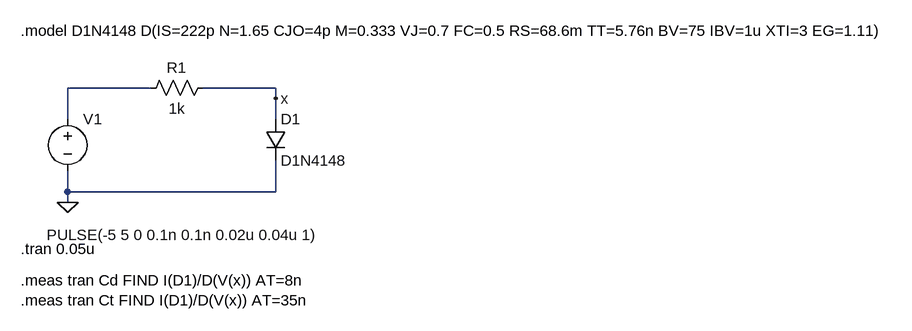
[diagram p0: schematic ej1.2.asc]
ej1.2.asc, the LTspice schematic file:
Version 4.1
SHEET 1 1264 680
WIRE 16 96 -112 96
WIRE 208 96 96 96
WIRE 208 112 208 96
WIRE -112 144 -112 96
WIRE 208 144 208 112
WIRE -112 256 -112 224
WIRE 208 256 208 208
WIRE 208 256 -112 256
WIRE -112 272 -112 256
FLAG -112 272 0
FLAG 208 112 x
SYMBOL voltage -112 128 R0
WINDOW 3 -32 194 Left 2
WINDOW 123 0 0 Left 0
WINDOW 39 0 0 Left 0
SYMATTR Value PULSE(-5 5 0 0.1n 0.1n 0.02u 0.04u 1)
SYMATTR InstName V1
SYMBOL res 112 80 R90
WINDOW 0 0 56 VBottom 2
WINDOW 3 32 56 VTop 2
SYMATTR InstName R1
SYMATTR Value 1k
SYMBOL diode 192 144 R0
SYMATTR InstName D1
SYMATTR Value D1N4148
TEXT -184 8 Left 2 !.model D1N4148 D(IS=222p N=1.65 CJO=4p M=0.333 VJ=0.7 FC=0.5 RS=68.6m TT=5.76n BV=75 IBV=1u XTI=3 EG=1.11)
TEXT -184 344 Left 2 !.tran 0.05u
TEXT -184 392 Left 2 !.meas tran Cd FIND I(D1)/D(V(x)) AT=8n\n.meas tran Ct FIND I(D1)/D(V(x)) AT=35n

The netlist it stands for:
* ej1.2.asc
V1 N001 0 PULSE(-5 5 0 0.1n 0.1n 0.02u 0.04u 1)
R1 x N001 1k
D1 x 0 D1N4148
.model D D
.lib standard.dio
.model D1N4148 D(IS=222p N=1.65 CJO=4p M=0.333 VJ=0.7 FC=0.5 RS=68.6m TT=5.76n BV=75 IBV=1u XTI=3 EG=1.11)
.tran 0.05u
.meas tran Cd FIND I(D1)/D(V(x)) AT=8n
.meas tran Ct FIND I(D1)/D(V(x)) AT=35n
.backanno
.end

* Results of the author's LTspice run, read from the files saved beside the schematic
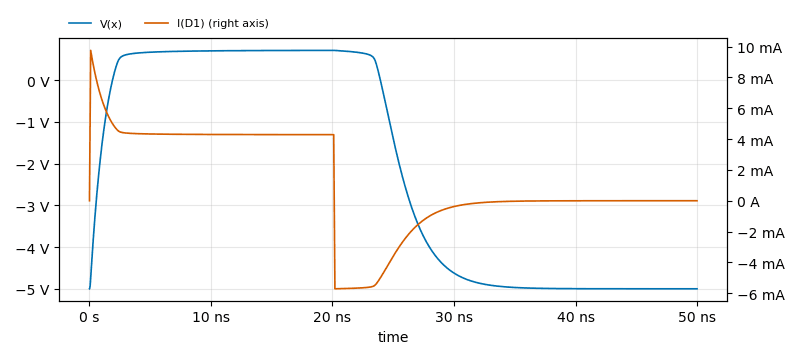
[diagram p1: Transient Analysis of ej1.2.asc, plotted from the saved traces]
* Transient Analysis, 1 run:
*   V(x): min -5 V, max 714.1 mV, average -2.131 V, rms 3.408 V, last -5 V
*   I(D1): min -5.713 mA, max 9.754 mA, average 1.151 mA, rms 3.422 mA, last -16.82 nA
* From the log:
*   cd: I(D1)/D(V(x)) =8.98076160063e-10 at 8e-09
*   ct: I(D1)/D(V(x)) =2.00207304895e-12 at 3.5e-08